# Altium schematic sheet Schematic.SchDoc
size A3; SheetNumber: 1; SheetTotal: 1
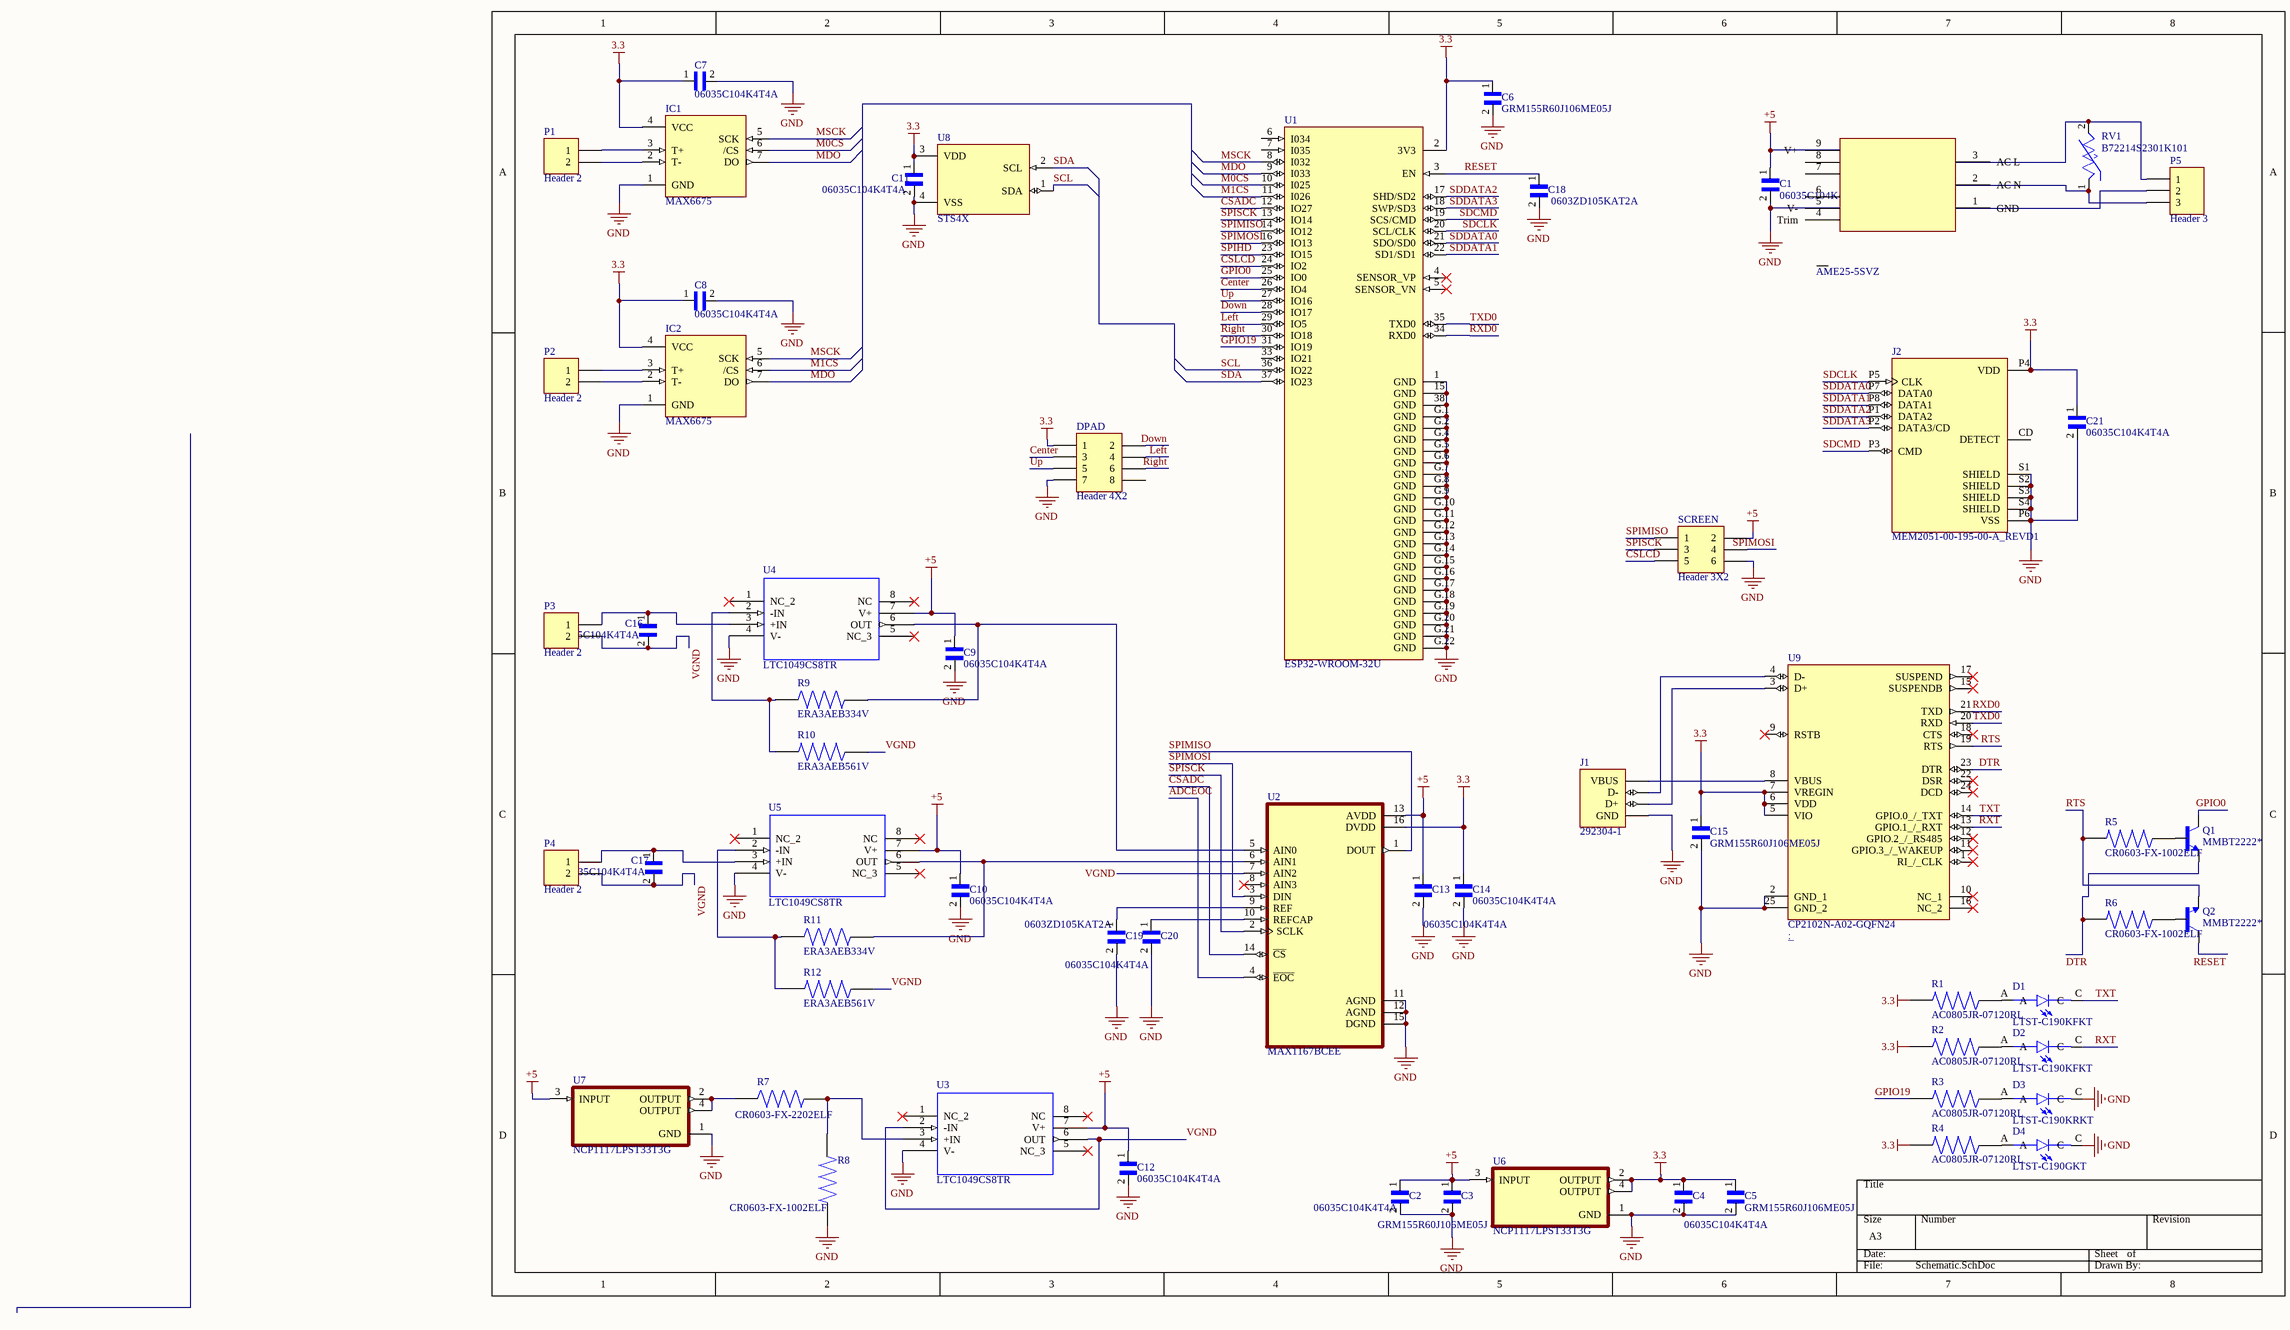
[diagram p0: Schematic.SchDoc]

## Parts
C1  06035C104K4T4A  [CAPC1608X90N]
C2  06035C104K4T4A  [CAPC1608X90N]
C3  GRM155R60J106ME05J  [CAPC1005X70N]
C4  06035C104K4T4A  [CAPC1608X90N]
C5  GRM155R60J106ME05J  [CAPC1005X70N]
C6  GRM155R60J106ME05J  [CAPC1005X70N]
C7  06035C104K4T4A  [CAPC1608X90N]
C8  06035C104K4T4A  [CAPC1608X90N]
C9  06035C104K4T4A  [CAPC1608X90N]
C10  06035C104K4T4A  [CAPC1608X90N]
C11  06035C104K4T4A  [CAPC1608X90N]
C12  06035C104K4T4A  [CAPC1608X90N]
C13  06035C104K4T4A  [CAPC1608X90N]
C14  06035C104K4T4A  [CAPC1608X90N]
C15  GRM155R60J106ME05J  [CAPC1005X70N]
C16  06035C104K4T4A  [CAPC1608X90N]
C17  06035C104K4T4A  [CAPC1608X90N]
C18  0603ZD105KAT2A  [CAPC1608X90N]
C19  0603ZD105KAT2A  [CAPC1608X90N]
C20  06035C104K4T4A  [CAPC1608X90N]
C21  06035C104K4T4A  [CAPC1608X90N]
D1  LTST-C190KFKT  [LEDM1608X80]
D2  LTST-C190KFKT  [LEDM1608X80]
D3  LTST-C190KRKT  [LEDC1608X35N]
D4  LTST-C190GKT  [LEDM1608X80]
DPAD  Header 4X2  [HDR2X4]
IC1  MAX6675  [SO08]
IC2  MAX6675  [SO08]
J1  292304-1  [TE_292304-1]
J2  MEM2051-00-195-00-A_REVD1  [GCT_MEM2051-00-195-00-A_REVD1]
P1  Header 2  [HDR1X2]
P2  Header 2  [HDR1X2]
P3  Header 2  [HDR1X2]
P4  Header 2  [HDR1X2]
P5  Header 3  [HDR1X3]
PS1  AME25-5SVZ  [CONV_KWS5A-5]
Q1  MMBT2222*  [SOT23-BEC]
Q2  MMBT2222*  [SOT23-BEC]
R1  AC0805JR-07120RL  [RESC2012X60N]
R2  AC0805JR-07120RL  [RESC2012X60N]
R3  AC0805JR-07120RL  [RESC2012X60N]
R4  AC0805JR-07120RL  [RESC2012X60N]
R5  CR0603-FX-1002ELF  [RESC1608X55N]
R6  CR0603-FX-1002ELF  [RESC1608X55N]
R7  CR0603-FX-2202ELF  [RESC1608X55N]
R8  CR0603-FX-1002ELF  [RESC1608X55N]
R9  ERA3AEB334V  [RES_ERA3AEB334V]
R10  ERA3AEB561V  [RES_ERA3AEB561V]
R11  ERA3AEB334V  [RES_ERA3AEB334V]
R12  ERA3AEB561V  [RES_ERA3AEB561V]
RV1  B72214S2301K101  [VAR_B72214S2301K101]
SCREEN  Header 3X2  [HDR2X3]
U1  ESP32-WROOM-32U  [XCVR_ESP32-WROOM-32U]
U2  MAX1167BCEE  [SOP63P602X175-16N]
U3  LTC1049CS8TR  [SO-8_S]
U4  LTC1049CS8TR  [SO-8_S]
U5  LTC1049CS8TR  [SO-8_S]
U6  NCP1117LPST33T3G  [SOT230P700X175-4N]
U7  NCP1117LPST33T3G  [SOT230P700X175-4N]
U8  STS4X  [STS4X]
U9  CP2102N-A02-GQFN24  [QFN50P400X400X80-25N]

## Nets
3.3: C4.1 C5.1 C6.1 C7.1 C8.1 C11.1 C14.1 C15.1 C21.1 DPAD.1 IC1.4(VCC) IC2.4(VCC) J2.P4(VDD) R1.2 R2.2 R4.2 U1.2(3V3) U2.16(DVDD) U6.2(OUTPUT) U6.4(OUTPUT) U8.3(VDD) U9.5(VIO) U9.6(VDD) U9.7(VREGIN)
+5: C1.1 C2.1 C3.1 C9.1 C10.1 C12.1 C13.1 PS1.9(V+) SCREEN.2 U2.13(AVDD) U3.7(V+) U4.7(V+) U5.7(V+) U6.3(INPUT) U7.3(INPUT)
GND: C1.2 C2.2 C3.2 C4.2 C5.2 C6.2 C7.2 C8.2 C9.2 C10.2 C11.2 C12.2 C13.2 C14.2 C15.2 C18.2 C19.2 C20.2 C21.2 D3.C D4.C DPAD.7 IC1.1(GND) IC2.1(GND) J1.4(GND) J2.P6(VSS) J2.S1(SHIELD) J2.S2(SHIELD) J2.S3(SHIELD) J2.S4(SHIELD) PS1.5(V-) R8.1 SCREEN.6 U1.1(GND) U1.15(GND) U1.38(GND) U1.G.1(GND) U1.G.2(GND) U1.G.4(GND) U1.G.5(GND) U1.G.6(GND) U1.G.7(GND) U1.G.8(GND) U1.G.9(GND) U1.G.10(GND) U1.G.11(GND) U1.G.12(GND) U1.G.13(GND) U1.G.14(GND) U1.G.15(GND) U1.G.16(GND) U1.G.17(GND) U1.G.18(GND) U1.G.19(GND) U1.G.20(GND) U1.G.21(GND) U1.G.22(GND) U2.11(AGND) U2.12(AGND) U2.15(DGND) U3.4(V-) U4.4(V-) U5.4(V-) U6.1(GND) U7.1(GND) U8.4(VSS) U9.2(GND_1) U9.25(GND_2)
ADCEOC: U2.4(~{EOC})
Center: DPAD.3 U1.26(IO4)
CSADC: U1.12(IO27) U2.14(~{CS})
CSLCD: SCREEN.5 U1.24(IO2)
Down: DPAD.2 U1.28(IO17)
DTR: Q1.E R6.2 U9.23(DTR)
GPIO0: Q1.C U1.25(IO0)
GPIO19: R3.2 U1.31(IO19)
Left: DPAD.4 U1.29(IO5)
M0CS: IC1.6(/CS) U1.10(I025)
M1CS: IC2.6(/CS) U1.11(I026)
MDO: IC1.7(DO) IC2.7(DO) U1.9(I033)
MSCK: IC1.5(SCK) IC2.5(SCK) U1.8(I032)
RESET: C18.1 Q2.C U1.3(EN)
Right: DPAD.6 U1.30(IO18)
RTS: Q2.E R5.2 U9.19(RTS)
RXD0: U1.34(RXD0) U9.21(TXD)
RXT: D2.C U9.13(GPIO.1_/_RXT)
SCL: U1.36(IO22) U8.1(SDA)
SDA: U1.37(IO23) U8.2(SCL)
SDCLK: J2.P5(CLK) U1.20(SCL/CLK)
SDCMD: J2.P3(CMD) U1.19(SCS/CMD)
SDDATA0: J2.P7(DATA0) U1.21(SDO/SD0)
SDDATA1: J2.P8(DATA1) U1.22(SD1/SD1)
SDDATA2: J2.P1(DATA2) U1.17(SHD/SD2)
SDDATA3: J2.P2(DATA3/CD) U1.18(SWP/SD3)
SPIHD: U1.23(IO15)
SPIMISO: SCREEN.1 U1.14(IO12) U2.1(DOUT)
SPIMOSI: SCREEN.4 U1.16(IO13) U2.3(DIN)
SPISCK: SCREEN.3 U1.13(IO14) U2.2(SCLK)
TXD0: U1.35(TXD0) U9.20(RXD)
TXT: D1.C U9.14(GPIO.0_/_TXT)
Up: DPAD.5 U1.27(IO16)
VGND: C16.2 C17.2 P3.2 P4.2 R10.1 R12.1 U2.7(AIN2) U3.2(-IN) U3.6(OUT)
NetC16_1: C16.1 P3.1 U4.3(+IN)
NetC17_1: C17.1 P4.1 U5.3(+IN)
NetC19_1: C19.1 U2.9(REF)
NetC20_1: C20.1 U2.10(REFCAP)
NetD1_A: D1.A R1.1
NetD2_A: D2.A R2.1
NetD3_A: D3.A R3.1
NetD4_A: D4.A R4.1
NetIC1_2: IC1.2(T-) P1.2
NetIC1_3: IC1.3(T+) P1.1
NetIC2_2: IC2.2(T-) P2.2
NetIC2_3: IC2.3(T+) P2.1
NetJ1_1: J1.1(VBUS) U9.8(VBUS)
NetJ1_2: J1.2(D-) U9.4(D-)
NetJ1_3: J1.3(D+) U9.3(D+)
NetP5_1: P5.1 PS1.3(AC_L) RV1.2
NetP5_2: P5.2 PS1.1(GND)
NetP5_3: P5.3 PS1.2(AC_N) RV1.1
NetQ1_B: Q1.B R5.1
NetQ2_B: Q2.B R6.1
NetR7_1: R7.1 U7.2(OUTPUT) U7.4(OUTPUT)
NetR7_2: R7.2 R8.2 U3.3(+IN)
NetR9_1: R9.1 R10.2 U4.2(-IN)
NetR9_2: R9.2 U2.5(AIN0) U4.6(OUT)
NetR11_1: R11.1 R12.2 U5.2(-IN)
NetR11_2: R11.2 U2.6(AIN1) U5.6(OUT)

Not connected (* = marked no-connect by the designer): DPAD 8; J2 CD(DETECT); PS1 4(Trim) 6(_) 7(_) 8(_); U1 4(SENSOR_VP)* 5(SENSOR_VN)* 6(I034) 7(I035) 33(IO21); U2 8(AIN3)*; U3 1(NC_2)* 5(NC_3)* 8(NC)*; U4 1(NC_2)* 5(NC_3)* 8(NC)*; U5 1(NC_2)* 5(NC_3)* 8(NC)*; U9 1(RI_/_CLK)* 9(RSTB)* 10(NC_1)* 11(GPIO.3_/_WAKEUP)* 12(GPIO.2_/_RS485)* 15(SUSPENDB)* 16(NC_2)* 17(SUSPEND)* 18(CTS)* 22(DSR)* 24(DCD)*

## Library data of the parts
C1 C2 C4 C7-C14 C16 C17 C20 C21 = 06035C104K4T4A: 0.1ÂµF Â±10% 50V Ceramic Capacitor X7R 0603 _1608 Metric_; MF: AVX; Digi-Key_Purchase_URL: https://www.digikey.com/product-detail/en/avx-corporation/06035C104K4T4A/478-9903-1-ND/6002664?utm_source=snapeda&utm_medium=aggregator&utm_campaign=symbol; Digi-Key_Part_Number: 478-9903-1-ND; SnapEDA_Link: https://www.snapeda.com/parts/06035C104K4T4A/AVX%20/%20Kyocera/view-part/1760822/?ref=snap; Package: 1608 AVX; MP: 06035C104K4T4A; Value: *
C18 C19 = 0603ZD105KAT2A: Cap Ceramic 1uF 10V X5R 10% SMD 0603 85Â°C Paper T/R; Package: None; Price: None; Value: *; MP: 0603ZD105KAT2A; Availability: Unavailable
D1 D2 = LTST-C190KFKT: Orange 605nm LED Indication - Discrete 2V 0603 (1608 Metric); MF: Lite-On Inc.; MP: LTST-C190KFKT; Purchase-URL: https://pricing.snapeda.com/search/part/LTST-C190KFKT/?ref=eda; SnapEDA_Link: https://www.snapeda.com/parts/LTST-C190KFKT/Lite-On%20Inc./view-part/46927/?ref=snap; Digi-Key_Part_Number: 160-1434-1-ND; Package: 0603 Lite-On; Value: *; Check_prices: https://www.snapeda.com/parts/LTST-C190KFKT/Lite-On%20Inc./view-part/46927/?ref=eda
D3 = LTST-C190KRKT: Red 631nm LED Indication - Discrete 2V 0603 _1608 Metric_; MF: Lite-On Inc.; Package: 0603 Lite-On; Digi-Key_Purchase_URL: https://www.digikey.com/product-detail/en/lite-on-inc/LTST-C190KRKT/160-1436-1-ND/386816?utm_source=snapeda&utm_medium=aggregator&utm_campaign=symbol; Value: *; MP: LTST-C190KRKT; SnapEDA_Link: https://www.snapeda.com/parts/LTST-C190KRKT/Lite-On%20Inc./view-part/49359/?ref=snap; Digi-Key_Part_Number: 160-1436-1-ND
D4 = LTST-C190GKT: Green 569nm LED Indication - Discrete 2.1V 0603 (1608 Metric); MF: Lite-On Inc.; DigiKey-Purchase-URL: https://snapeda.com/shop?store=DigiKey&id=46935; Package: 0603 Lite-On; Value: *; Digi-Key_Part_Number: 160-1183-1-ND; SnapEDA_Link: https://www.snapeda.com/parts/LTST-C190GKT/Lite-On%20Inc./view-part/46935/?ref=snap; MP: LTST-C190GKT
DPAD = Header 4X2: Header, 4-Pin, Dual row; LatestRevisionDate: 17-Jul-2002; LatestRevisionNote: Re-released for DXP Platform.; Publisher: Altium Limited
IC1 IC2 = MAX6675: IC THERMOCOUP TO DGTL 8-SOIC; MF: Maxim Integrated; Package: SOIC-8 Maxim Integrated; Availability: Unavailable; MP: MAX6675; Value: *; SnapEDA_Link: https://www.snapeda.com/parts/MAX6675/Maxim%20Integrated/view-part/558569/?ref=snap; Price: None
J1 = 292304-1: CONN USB RECEPT R/A TYPE B 4POS; Price: None; MP: 292304-1; Availability: Unavailable; Value: *; Package: None
P1-P4 = Header 2: Header, 2-Pin; LatestRevisionDate: 17-Jul-2002; LatestRevisionNote: Re-released for DXP Platform.; Publisher: Altium Limited
P5 = Header 3: Header, 3-Pin; LatestRevisionDate: 17-Jul-2002; LatestRevisionNote: Re-released for DXP Platform.; Publisher: Altium Limited
PS1 = AME25-5SVZ: Enclosed AC DC Converters; MF: TDK-Lambda Americas Inc; MP: KWS5A-5; Check_prices: https://www.snapeda.com/parts/KWS5A-5/TDK-Lambda+Americas+Inc/view-part/?ref=eda; SnapEDA_Link: https://www.snapeda.com/parts/KWS5A-5/TDK-Lambda+Americas+Inc/view-part/?ref=snap; Price: None; Package: DIP-4 TDK-Lambda; Availability: In Stock; Purchase-URL: https://pricing.snapeda.com/search/part/KWS5A-5/?ref=eda; Value: *
Q1 Q2 = MMBT2222*: Bipolar _BJT_ Transistor NPN 30V 600mA 250MHz 350mW Surface Mount SOT-23-3; MF: ON Semiconductor; Package: SOT-23-3 Fairchild Semiconductor; Value: *; Price: None; MP: MMBT2222; Availability: Unavailable; SnapEDA_Link: https://www.snapeda.com/parts/MMBT2222/ON%20Semiconductor/view-part/214298/?ref=snap
R1-R4 = AC0805JR-07120RL: AC0805 120R 5% 0,125W AUTOMO; Package: None; Price: None; Value: *; MP: AC0805JR-07120RL; Availability: Unavailable
R5 R6 R8 = CR0603-FX-1002ELF: 10 kOhms Â±1% 0.1W, 1/10W Chip Resistor 0603 _1608 Metric_ Moisture Resistant Thick Film; MF: Bourns; Price: None; Package: 1608 Rohm Semiconductor; MP: CR0603-FX-1002ELF; Value: *; Availability: Unavailable; SnapEDA_Link: https://www.snapeda.com/parts/CR0603-FX-1002ELF/Bourns/view-part/52302/?ref=snap
R7 = CR0603-FX-2202ELF: Res Thick Film 0603 22K Ohm 1% 1/10W Â±100ppm/Â°C Molded SMD SMD Paper Tape on Plastic Reel; Package: None; Price: None; Value: *; MP: CR0603-FX-2202ELF; Availability: Unavailable
RV1 = B72214S2301K101: MF: TDK ELECTRONICS; SnapEDA_Link: https://www.snapeda.com/parts/B72214S2301K101/TM+Electronics/view-part/?ref=snap; Availability: In Stock; Price: None; MP: B72214S2301K101; Check_prices: https://www.snapeda.com/parts/B72214S2301K101/TM+Electronics/view-part/?ref=eda; Purchase-URL: https://pricing.snapeda.com/search/part/B72214S2301K101/?ref=eda; Package: None; Value: *
SCREEN = Header 3X2: Header, 3-Pin, Dual row; LatestRevisionDate: 17-Jul-2002; LatestRevisionNote: Re-released for DXP Platform.; Publisher: Altium Limited
U1 = ESP32-WROOM-32U: Bluetooth, WiFi 802.11b/g/n, Bluetooth v4.2 +EDR, Class 1, 2 and 3 Transceiver Module 2.4GHz ~ 2.5GHz Antenna Not Included, U.FL Surface Mount; MF: Espressif Systems; Value: *; Purchase-URL: https://pricing.snapeda.com/search/part/ESP32-WROOM-32U/?ref=eda; Package: Module Espressif Systems; Availability: In Stock; SnapEDA_Link: https://www.snapeda.com/parts/ESP32-WROOM-32U/Espressif+Systems/view-part/?ref=snap; MP: ESP32-WROOM-32U; Check_prices: https://www.snapeda.com/parts/ESP32-WROOM-32U/Espressif+Systems/view-part/?ref=eda; Price: None
U6 U7 = NCP1117LPST33T3G: Linear Voltage Regulator IC 1 Output 1A SOT-223; MF: ON Semiconductor; Availability: Unavailable; Value: *; Package: SOT-223 ON Semiconductor; MP: NCP1117LPST33T3G; Price: None; SnapEDA_Link: https://www.snapeda.com/parts/NCP1117LPST33T3G/ON%20Semiconductor/view-part/421194/?ref=snap
U8 = STS4X: Digital Temperature Sensor, Â±0.2 Â°C, Ultra-Low-Power, I2C fast mode plus; MF: Sensirion; MP: STS40-CD1B-R3; SnapEDA_Link: https://www.snapeda.com/parts/STS40-CD1B-R3/Sensirion/view-part/?ref=snap; Price: None; Value: *; Check_prices: https://www.snapeda.com/parts/STS40-CD1B-R3/Sensirion/view-part/?ref=eda; Availability: In Stock; Package: DFN-4 Sensirion; Purchase-URL: https://pricing.snapeda.com/search/part/STS40-CD1B-R3/?ref=eda
U9 = CP2102N-A02-GQFN24: USB Bridge, USB to UART USB 2.0 UART Interface 24-QFN (4x4); MF: Silicon Labs; SnapEDA_Link: https://www.snapeda.com/parts/CP2102N-A02-GQFN24/Silicon%20Labs/view-part/3656696/?ref=snap; Value: *; Price: None; Availability: Warning; Mouser-Purchase-URL: https://snapeda.com/shop?store=Mouser&id=3656696; MP: CP2102N-A02-GQFN24; Package: WFQFN-24 Silicon Labs
C3 C5 C6 C15 = GRM155R60J106ME05J: Package: None; Price: None; Value: *; MP: GRM155R60J106ME05J; Availability: Unavailable
J2 = MEM2051-00-195-00-A_REVD1: Package: None; Availability: Unavailable; Value: *; MP: MEM2051-00-195-00-A_REVD1; Price: None
R9 R11 = ERA3AEB334V: Price: None; MP: ERA3AEB334V; Package: None; Availability: Unavailable; Value: *
R10 R12 = ERA3AEB561V: Price: None; Availability: Unavailable; MP: ERA3AEB561V; Package: None; Value: *
U2 = MAX1167BCEE: Package: None; Price: None; Value: *; MP: MAX1167BCEE; Availability: Unavailable
U3-U5 = LTC1049CS8TR: Package: None; Price: None; Value: *; MP: LTC1049CS8TR; Availability: Unavailable